# Altium schematic sheet power-v5v5n.SchDoc: Power -5.5V
size Letter; CheckedBy: J. Brinton; CompanyName: Signal Laboratories, Inc.; DrawnBy: J. Brinton; Engineer: J. Brinton; Address1: 3479 Edison Way; Address2: Menlo Park CA 94025; Address3: +1 (877) 778-8435; Address4: siglabs.com; Revision: 3; SheetNumber: 4; SheetTotal: 7
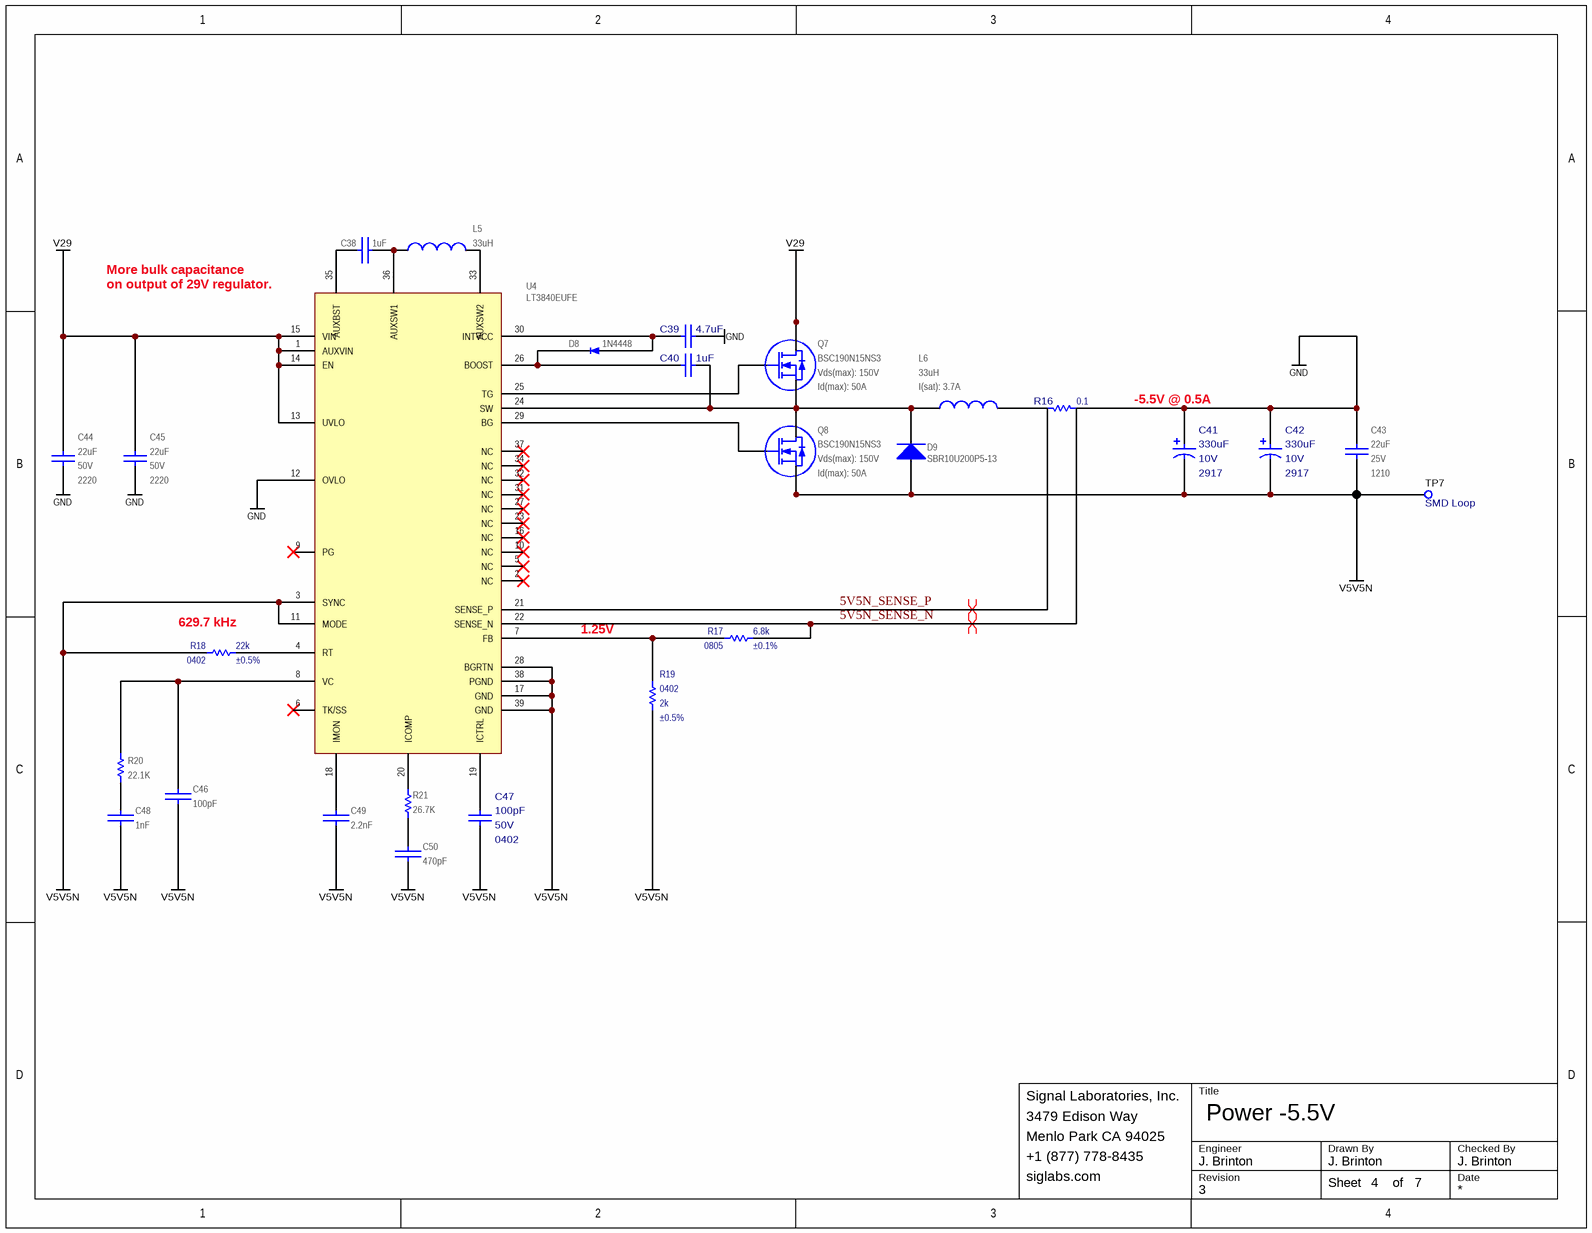
[diagram p0: power-v5v5n.SchDoc]

## Parts
C38  value 1uF  [CAPC100X50X55L25N]  (hidden comment: GRM155R61A105KE15)
C39  value 4.7uF  [CAPC160X80X90L20NA]  (hidden comment: CL10A475KA8NQNC)
C40  value 1uF  [CAPC100X50X55L25N]  (hidden comment: GRM155R61A105KE15)
C41  value 330uF  Package: 2917  Voltage: 10V  [CAPPM730X435X310L135X240N]  (hidden comment: TPSE337K010R0050)
C42  value 330uF  Package: 2917  Voltage: 10V  [CAPPM730X435X310L135X240N]  (hidden comment: TPSE337K010R0050)
C43  value 22uF  Voltage: 25V  Package: 1210  [CAPC320X250X270L50N]  (hidden comment: GRM32ER71E226KE15)
C44  value 22uF  Voltage: 50V  Package: 2220  [CAPC600X500X500L160N]  (hidden comment: CKG57NX7S1H226M500JJ)
C45  value 22uF  Voltage: 50V  Package: 2220  [CAPC600X500X500L160N]  (hidden comment: CKG57NX7S1H226M500JJ)
C46  value 100pF  [CAPC100X50X55L25N]  (hidden comment: GRM1555C1H101FA01D)
C47  value 100pF  Package: 0402  Voltage: 50V  [CAPC100X50X55L25N]  (hidden comment: VJ0402A101KXA)
C48  value 1nF  [CAPC100X50X55L25N]  (hidden comment: GRM1555C1H102JA01)
C49  value 2.2nF  [CAPC100X50X55L25N]  (hidden comment: C0402C222J3GACTU)
C50  value 470pF  [CAPC100X50X55L25N]  (hidden comment: GRM155R71H471JA01)
D8  Alternative P/N: 1N4448  [SOD323]  (hidden comment: 1N4448HWS-7-F)
D9  SBR10U200P5-13  [DIODES_POWERDI5]
L5  value 33uH  [ME3220]  (hidden comment: ME3220-333KL)
L6  value 33uH  I(sat): 3.7A  [XAL6060]  (hidden comment: XAL6060-333ME)
Q7  BSC190N15NS3  Vds(max): 150V  Id(max): 50A  [TDSON-8]
Q8  BSC190N15NS3  Vds(max): 150V  Id(max): 50A  [TDSON-8]
R16  value 0.1  [KRL3216T4]  (hidden comment: KRL3216T4A-M-R100-F)
R17  value 6.8k  Tolerance: ±0.1%  Package: 0805  [RESC2012X70N]  (hidden comment: RG2012P-682-B-T5)
R18  value 22k  Tolerance: ±0.5%  Package: 0402  [RESC1005X40N]  (hidden comment: RR0510P-223-D)
R19  value 2k  Tolerance: ±0.5%  Package: 0402  [RESC1005X40N]  (hidden comment: RR0510P-202-D)
R20  value 22.1K  [RESC1005X40N]  (hidden comment: ERJ-2RKF2212X)
R21  value 26.7K  [RESC1005X40N]  (hidden comment: ERJ-2RKF2672X)
TP7  Notes: SMD Loop  [5015]  (hidden comment: 5015)
U4  LT3840EUFE  [QFN39P40_600X400X80L40X20T465X265N]

## Nets
GND: C39.2 C41.1 C42.1 C43.2 C44.1 C45.1 R16.2 U4.12(OVLO)
V5V5N: C41.2 C42.2 C43.1 C46.1 C47.2 C48.2 C49.2 C50.1 D9.A Q8.1(S) Q8.2(S) Q8.3(S) R18.2 R19.1 TP7.1 U4.3(SYNC) U4.11(MODE) U4.17(GND) U4.28(BGRTN) U4.38(PGND) U4.39(GND)
V29: C44.2 C45.2 Q7.5(D) Q7.6(D) Q7.7(D) Q7.8(D) Q7.9(D) U4.1(AUXVIN) U4.13(UVLO) U4.14(EN) U4.15(VIN)
5V5N_SENSE_N: R16.4 R17.1 U4.22(SENSE_N)
5V5N_SENSE_P: R16.3 U4.21(SENSE_P)
NetC38_1: C38.1 L5.1 U4.36(AUXSW1)
NetC38_2: C38.2 U4.35(AUXBST)
NetC39_1: C39.1 D8.A U4.30(INTVCC)
NetC40_1: C40.1 D8.K U4.26(BOOST)
NetC40_2: C40.2 D9.K L6.1 Q7.1(S) Q7.2(S) Q7.3(S) Q8.5(D) Q8.6(D) Q8.7(D) Q8.8(D) Q8.9(D) U4.24(SW)
NetC46_2: C46.2 R20.2 U4.8(VC)
NetC47_1: C47.1 U4.19(ICTRL)
NetC48_1: C48.1 R20.1
NetC49_1: C49.1 U4.18(IMON)
NetC50_2: C50.2 R21.2
NetL5_2: L5.2 U4.33(AUXSW2)
NetL6_2: L6.2 R16.1
NetQ7_4: Q7.4(G) U4.25(TG)
NetQ8_4: Q8.4(G) U4.29(BG)
NetR17_2: R17.2 R19.2 U4.7(FB)
NetR18_1: R18.1 U4.4(RT)
NetR21_1: R21.1 U4.20(ICOMP)

Not connected (* = marked no-connect by the designer): U4 2(NC)* 5(NC)* 6(TK/SS)* 9(PG)* 10(NC)* 16(NC)* 23(NC)* 27(NC)* 31(NC)* 32(NC)* 34(NC)* 37(NC)*

## Layout directives
differential pair: 5V5N_SENSE_N, 5V5N_SENSE_P

## Notes on the sheet
- More bulk capacitance
- (near U4) on output of 29V regulator.
- -5.5V @ 0.5A
- (near R18) 629.7 kHz
- 1.25V
- Title
- Engineer
- Revision
- Drawn By
- Checked By
- Date
- Sheet
- of

## Library data of the parts
C38 = CAP: Ceramic Capacitor 1uF ±10% 10V X5R 0402; Manufacturer: Murata; Tr: -55:125; Manufacturer P/N: GRM155R61A105KE15; Package: 0402; Tolerance: ±10%; Voltage: 10V
C39 = TMK212B7475KG: Ceramic Capacitor 4.7uF ±10% 25V X5R 0603; Manufacturer: Samsung; Tr: -55:85; Manufacturer P/N: CL10A475KA8NQNC; Tolerance: ±10%; Package: 0603; Voltage: 25V
C40 = UMK212B7105KG: Ceramic Capacitor 1uF ±10% 10V X5R 0402; Manufacturer: Murata; Voltage: 50V; Manufacturer P/N: GRM155R61A105KE15; Tolerance: ±10%; Tr: *; Package: 0402
C41 C42 = CAP_POL: Tantalum Capacitor 330uF ±10% 10V 2917; Manufacturer: AVX; Tr: -55:125; Manufacturer P/N: TPSE337K010R0050; Tolerance: ±10%
C43 = CAP: Ceramic Capacitor 22uF ±10% 25V X7R 1210; Manufacturer: Murata; Tr: -55:125; Manufacturer P/N: GRM32ER71E226KE15; Tolerance: ±10%
C44 C45 = CAP: Ceramic Capacitor 22uF ±20% 50V X7S Stacked; Manufacturer: TDK; Tr: -55:125; Manufacturer P/N: CKG57NX7S1H226M500JJ; Tolerance: ±20%
C46 = CAP: Ceramic Capacitor 100pF ±1% 50V NP0 0402; Manufacturer: Murata; Tr: -55:125; Manufacturer P/N: GRM1555C1H101FA01D; Voltage: 50V; Package: 0402; Tolerance: ±1%
C47 = VJ0402A101KXA: Ceramic Capacitor 100pF ±10% 50V C0G 0402; Manufacturer: Vishay; Tr: -55:150; Manufacturer P/N: VJ0402A101KXA; Tolerance: ±10%
C48 = CAP: Ceramic Capacitor 1nF ±5% 50V NP0 0402; Manufacturer: Murata; Tr: -55:125; Manufacturer P/N: GRM1555C1H102JA01; Voltage: 50V; Package: 0402; Tolerance: ±5%
C49 = CAP: Ceramic Capacitor 2.2nF ±5% 25V NP0 0402; Manufacturer: Kemet; Tr: -55:125; Manufacturer P/N: C0402C222J3GACTU; Package: 0402; Tolerance: ±5%; Voltage: 25V
C50 = CAP: Ceramic Capacitor 470pF ±5% 50V X7R 0402; Manufacturer: Murata; Tr: -55:125; Manufacturer P/N: GRM155R71H471JA01; Voltage: 50V; Package: 0402; Tolerance: ±5%
D8 = 1N4448HWS-7-F: Schottky Diode 80V 250mA SOD323; Manufacturer: Diodes Inc; Manufacturer P/N: 1N4448HWS-7-F; Package: SOD323
D9 = PDS5100H: Schottky Diode 200V 10A SMD; Manufacturer: Diodes Inc; Manufacturer P/N: SBR10U200P5-13; Current: 10A; Reverse Voltage (max): 200V; Package: PowerDi-5
L5 = COIL: Inductor 33uH ±10% 500mA SMD; Manufacturer: Coilcraft; Tr: -40:85; Manufacturer P/N: ME3220-333KL; I(sat): 500mA; Package: *; Tolerance: ±10%
L6 = COIL: Inductor 33uH,3.7A(sat), SMD; Manufacturer: Coilcraft; Manufacturer P/N: XAL6060-333ME
Q7 Q8 = BSC190N15NS3: MOSFET N-Channel Enhancement Mode; Manufacturer: Infineon; Rds(on): 19mOhm; Manufacturer P/N: BSC190N15NS3
R16 = KRL3216T4A-M-R009-F: Current Sense Resistor 100 mOhms +/-1% SMD 4-Terminal; Manufacturer: Susumu; Tolerance: ±1%; Tr: -55:+155; Manufacturer P/N: KRL3216T4A-M-R100-F
R17 = RES: Thin Film Resistor 6.8k +/-0.1% SMD 0805; Manufacturer: Susumu; Tr: -55:155; Tcr: *; Manufacturer P/N: RG2012P-682-B-T5; Alternatives: *; Voltage: *; Power: *
R18 = RES: Thin Film Resistor 22k +/-0.5% SMD 0402; Manufacturer: Susumu; Tr: -55:155; Tcr: *; Manufacturer P/N: RR0510P-223-D; Alternatives: *; Voltage: *; Power: *
R19 = RES: Thin Film Resistor 2k +/-0.5% SMD 0402; Manufacturer: Susumu; Tr: -55:155; Tcr: *; Manufacturer P/N: RR0510P-202-D; Alternatives: *; Voltage: *; Power: *
R20 = RES 0402: Thick Film Resistor 22.1k ±1% 0402; Manufacturer: Panasonic; Tr: -55:155; Package: 0402; Manufacturer P/N: ERJ-2RKF2212X; Tolerance: ±1%
R21 = RES 0402: Thick Film Resistor 26.7k ±1% 0402; Manufacturer: Panasonic; Tr: -55:155; Package: 0402; Manufacturer P/N: ERJ-2RKF2672X; Tolerance: ±1%
TP7 = TEST_POINT_SMD_50: Test Point SMD; Manufacturer: Keystone; Manufacturer P/N: 5015
U4 = LT3840EUFE: Synchronous Regulator Controller; Manufacturer: Linear Technology; Alternative P/N: LT3840IUFE; Manufacturer P/N: LT3840EUFE